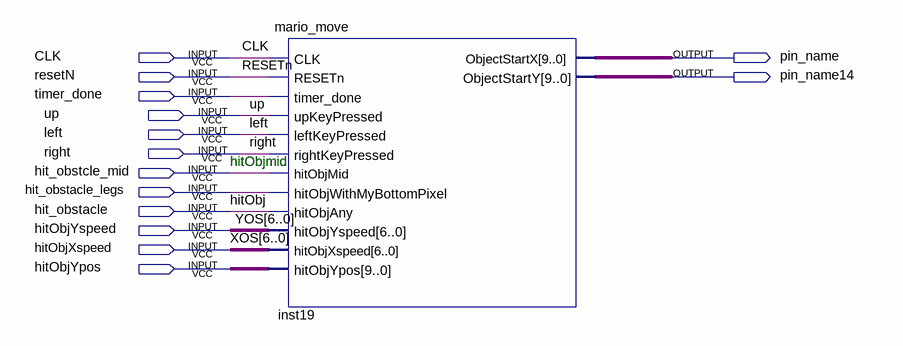
[diagram p0: schematic sheet]
// Quartus schematic mario_sim.bdf as structural Verilog: 1 symbols, 14 pins
module mario_sim (
  input  CLK,
  input  resetN,
  input  timer_done,
  input  up,
  input  left,
  input  right,
  input  hit_obstcle_mid,
  input  hit_obstacle_legs,
  input  hit_obstacle,
  input  hitObjYspeed,
  input  hitObjXspeed,
  input  hitObjYpos,
  output pin_name,
  output pin_name14
);

  wire [6:0] XOS, YOS;
  wire [9:0] inst19_objectstartx, inst19_objectstarty, undriven;

  mario_move inst19 (
    .CLK(CLK), .RESETn(resetN), .timer_done(timer_done), .upKeyPressed(up), .leftKeyPressed(left),
    .rightKeyPressed(right), .hitObjMid(hit_obstcle_mid), .hitObjWithMyBottomPixel(hit_obstacle_legs),
    .hitObjAny(hit_obstacle), .hitObjYspeed(YOS), .hitObjXspeed(XOS), .hitObjYpos(undriven),
    .ObjectStartX(inst19_objectstartx), .ObjectStartY(inst19_objectstarty));

  // Other names for the same wires on the sheet: hitObj = hit_obstacle; hitObjmid = hit_obstcle_mid

  // Notes on the sheet:
  //   hitObjmid
endmodule
